# EAGLE design pcb2.0 (EAGLE 9.6.2)
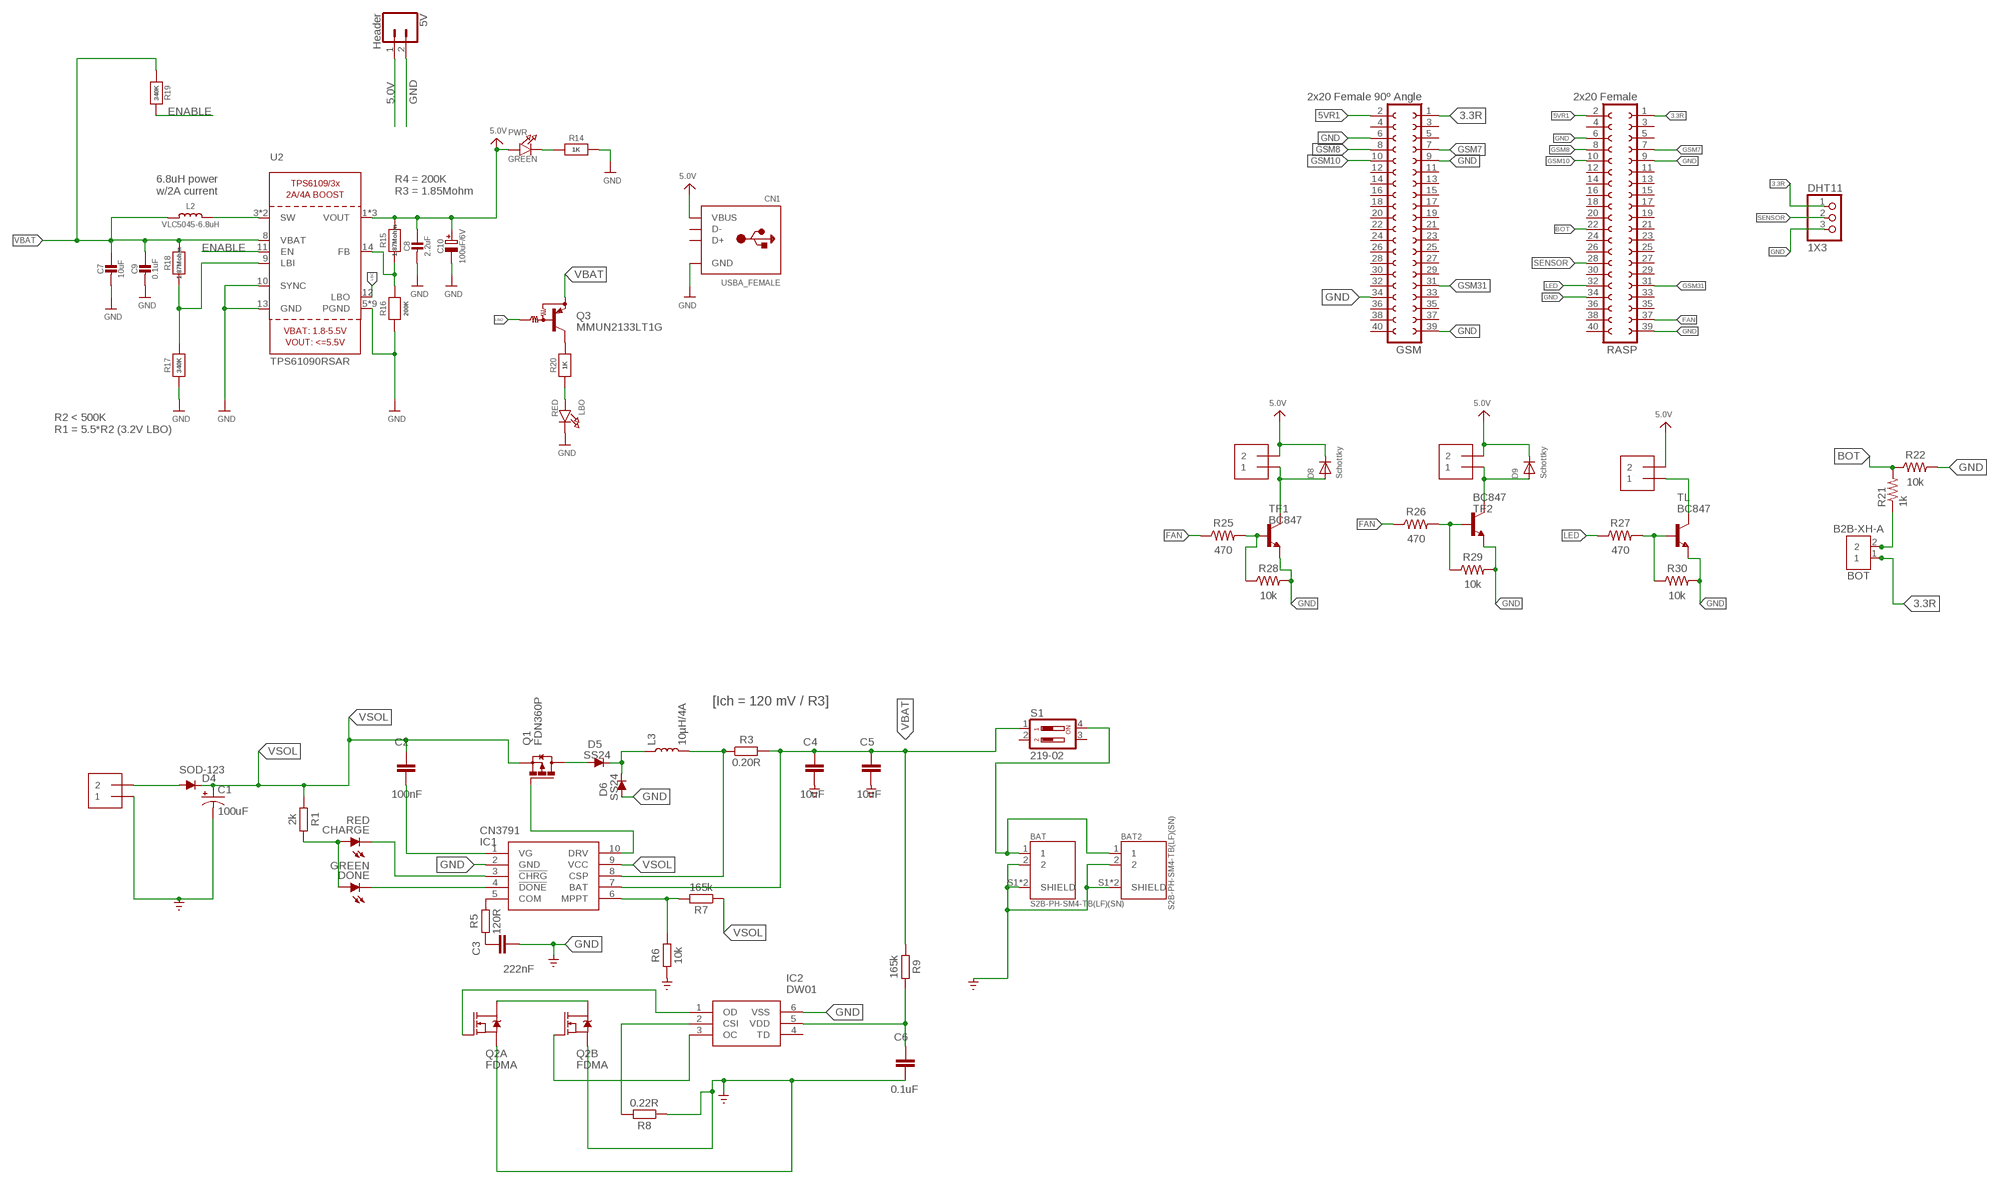
[diagram p0: schematic, sheet 1]

## Parts
5V  Header  CONN_02  [1X02]
BAT  S2B-PH-SM4-TB(LF)(SN)  [S2B-PH-SM4-TB(LF)(SN)]
BAT2  S2B-PH-SM4-TB(LF)(SN)  [S2B-PH-SM4-TB(LF)(SN)]
BOT  B2B-XH-A  [B2B-XH-A]
C1  100uF  CPOL-US153CLV-0505  [153CLV-0505]
C2  100nF  C0603C120J5GACTU  [CAP_0603]
C3  222nF  C0603C120J5GACTU  [CAP_0603]
C4  10uF  C0603C120J5GACTU  [CAP_0603]
C5  10uF  C0603C120J5GACTU  [CAP_0603]
C6  0.1uF  C0603C120J5GACTU  [CAP_0603]
C7  10uF  CAP_CERAMIC0805-NOOUTLINE  [0805-NO]
C8  2.2uF  CAP_CERAMIC0805-NOOUTLINE  [0805-NO]
C9  0.1uF  CAP_CERAMIC0805-NOOUTLINE  [0805-NO]
C10  100uF/6V  CAP_TANTALUMB/3528_REFLOW  [EIA3528-21/B-R]
CHARGE  RED  LED_LEDCHIP-LED0603MP  [LED_CHIP-LED0603MP]
CN1  USBA_FEMALE  USB_TYPEAPTHFML  [USB_HOST-PTH]
D4  SOD-123  DIODE_DIODE-SOD123  [DIODE_SOD123]
D5  SS24  DIODE_DIODE-SOD123  [DIODE_SOD123]
D6  SS24  DIODE_DIODE-SOD123  [DIODE_SOD123]
D8  Schottky  DIODESOD-123  [SOD-123]
D9  Schottky  DIODESOD-123  [SOD-123]
DHT11  1X3  PINHD-1X3  [1X03]
DONE  GREEN  LED_LEDCHIP-LED0603MP  [LED_CHIP-LED0603MP]
FAN1  1X2-3.5MM  [1X2-3.5MM]
FAN2  1X2-3.5MM  [1X2-3.5MM]
GSM  2x20 Female 90º Angle  FE20-2W  [FE20-2W]
IC1  CN3791  [SOP100P600X175-10N]
IC2  DW01  [SOT95P280X135-6N]
L2  VLC5045-6.8uH  INDUCTORTDK_VLC5045  [INDUCTOR_5X5MM_TDK_VLC5045]
L3  10µH/4A  INDUCTOR-CR54-3.3UH  [CR54]
LBO  RED  LED0805_NOOUTLINE  [CHIPLED_0805_NOOUTLINE]
LED  1X2-3.5MM  [1X2-3.5MM]
PWR  GREEN  LED0805_NOOUTLINE  [CHIPLED_0805_NOOUTLINE]
Q1  FDN360P  [SUPER-SOT3]
Q2  FDMA  MOSFET_NCH_DUAL-FDMA1024NZ  [MICROFET_2X2]
Q3  MMUN2133LT1G  MUN2114T1-PNP_DRIVER-SC59-BEC  [SC59-BEC]
R1  2k  R_CHIP-0603(1608-METRIC)  [RESC1608X60]
R3  0.20R  R_CHIP-0603(1608-METRIC)  [RESC1608X60]
R5  120R  R_CHIP-0603(1608-METRIC)  [RESC1608X60]
R6  10k  R_CHIP-0603(1608-METRIC)  [RESC1608X60]
R7  165k  R_CHIP-0603(1608-METRIC)  [RESC1608X60]
R8  0.22R  R_CHIP-0603(1608-METRIC)  [RESC1608X60]
R9  165k  R_CHIP-0603(1608-METRIC)  [RESC1608X60]
R14  1K  RESISTOR0805_NOOUTLINE  [0805-NO]
R15  1.87Mohm  RESISTOR0805_NOOUTLINE  [0805-NO]
R16  200K  RESISTOR0805_NOOUTLINE  [0805-NO]
R17  340K  RESISTOR0805_NOOUTLINE  [0805-NO]
R18  1.87Mohm  RESISTOR0805_NOOUTLINE  [0805-NO]
R19  340K  RESISTOR0805_NOOUTLINE  [0805-NO]
R20  1K  RESISTOR0805_NOOUTLINE  [0805-NO]
R21  1k  R-US_R0805  [R0805]
R22  10k  R-US_CHIP-0805(2012-METRIC)  [RESC2012X65]
R25  470  R-US_CHIP-0805(2012-METRIC)  [RESC2012X65]
R26  470  R-US_CHIP-0805(2012-METRIC)  [RESC2012X65]
R27  470  R-US_CHIP-0805(2012-METRIC)  [RESC2012X65]
R28  10k  R-US_CHIP-0805(2012-METRIC)  [RESC2012X65]
R29  10k  R-US_CHIP-0805(2012-METRIC)  [RESC2012X65]
R30  10k  R-US_CHIP-0805(2012-METRIC)  [RESC2012X65]
RASP  2x20 Female  FE20-2  [FE20-2]
S1  219-02  [CTS-219-02]
TF1  BC847  [SOT23]
TF2  BC847  [SOT23]
TL  BC847  [SOT23]
U2  TPS61090RSAR  VREG_TPS6103X  [PVQFN-16]
VIN  1X2-3.5MM  [1X2-3.5MM]

## Nets
3.3R: BOT.1 DHT11.1 GSM.1 RASP.1
5.0V: 5V.1 C8.1 C10.+ CN1.VBUS D8.C D9.C FAN1.2 FAN2.2 LED.2 PWR.A R15.2 U2.1(VOUT) U2.15(VOUT) U2.16(VOUT)
5VR1: GSM.2 RASP.2
BOT: R21.2 R22.1 RASP.22
ENABLE: R19.2 U2.11(EN)
FAN: R25.1 R26.1 RASP.37
GND: 5V.2 BAT2.2 BAT2.S1(SHIELD) BAT2.S2(SHIELD) BAT.2 BAT.S1(SHIELD) BAT.S2(SHIELD) C1.- C3.2 C4.2 C5.2 C6.2 C7.2 C8.2 C9.2 C10.- CN1.GND D6.A DHT11.3 GSM.6 GSM.9 GSM.34 GSM.39 IC1.2(GND) IC2.6(VSS) LBO.C Q2.S1(A:S) Q2.S2(B:S) R6.1 R8.1 R14.2 R16.1 R17.1 R22.2 R28.2 R29.2 R30.2 RASP.6 RASP.9 RASP.34 RASP.39 TF1.2(E) TF2.2(E) TL.2(E) U2.5(PGND) U2.6(PGND) U2.7(PGND) U2.10(SYNC) U2.13(GND) U2.P$18(PGND) U2.P$19(PGND) U2.P$20(PGND) U2.P$21(PGND) U2.P$22(PGND) U2.THERMAL(PGND) VIN.1 ; supply symbol labelled SUPPLY_BRASTAN_GND_
GSM7: GSM.7 RASP.7
GSM8: GSM.8 RASP.8
GSM10: GSM.10 RASP.10
GSM31: GSM.31 RASP.31
LBO: Q3.B U2.12(LBO)
LED: R27.1 RASP.32
N$2: L2.P$2 U2.3(SW) U2.4(SW)
N$3: C2.2 IC1.1(VG)
N$4: CHARGE.C IC1.3(!CHRG)
N$5: IC1.8(CSP) L3.P$2 R3.1
N$6: CHARGE.A DONE.A R1.2
N$7: DONE.C IC1.4(!DONE)
N$8: IC1.5(COM) R5.2
N$9: C3.1 R5.1
N$10: IC1.10(DRV) Q1.1(G)
N$11: R17.2 R18.1 U2.9(LBI)
N$12: D5.A Q1.3(D)
N$13: D5.C D6.C L3.P$1
N$14: IC1.6(MPPT) R6.2 R7.2
N$15: Q2.D1(A:D) Q2.D1_2(A:D) Q2.D2(B:D) Q2.D2_2(B:D)
N$16: BAT2.1 BAT.1 S1.4
N$17: IC2.1(OD) Q2.G1(A:G)
N$18: IC2.3(OC) Q2.G2(B:G)
N$19: C6.1 IC2.5(VDD) R9.2
N$20: IC2.2(CSI) R8.2
N$21: BOT.2 R21.1
N$22: PWR.C R14.1
N$24: LBO.A R20.1
N$25: Q3.C R20.2
N$26: R15.1 R16.2 U2.14(FB)
N$31: R25.2 R28.1 TF1.1(B)
N$32: R26.2 R29.1 TF2.1(B)
N$33: R27.2 R30.1 TL.1(B)
N$34: D8.A FAN1.1 TF1.3(C)
N$35: D9.A FAN2.1 TF2.3(C)
N$36: LED.1 TL.3(C)
SENSOR: DHT11.2 RASP.28
VBAT: C4.1 C5.1 C7.1 C9.1 IC1.7(BAT) L2.P$1 Q3.E R3.2 R9.1 R18.2 R19.1 S1.1 U2.8(VBAT)
VSOL: C1.+ C2.1 D4.C IC1.9(VCC) Q1.2(S) R1.1 R7.1
VSOLAR [VIN]: D4.A VIN.2
Unconnected: CN1.D+ CN1.D- GSM.3 GSM.4 GSM.5 GSM.11 GSM.12 GSM.13 GSM.14 GSM.15 GSM.16 GSM.17 GSM.18 GSM.19 GSM.20 GSM.21 GSM.22 GSM.23 GSM.24 GSM.25 GSM.26 GSM.27 GSM.28 GSM.29 GSM.30 GSM.32 GSM.33 GSM.35 GSM.36 GSM.37 GSM.38 GSM.40 IC2.4(TD) RASP.3 RASP.4 RASP.5 RASP.11 RASP.12 RASP.13 RASP.14 RASP.15 RASP.16 RASP.17 RASP.18 RASP.19 RASP.20 RASP.21 RASP.23 RASP.24 RASP.25 RASP.26 RASP.27 RASP.29 RASP.30 RASP.33 RASP.35 RASP.36 RASP.38 RASP.40 S1.2 S1.3

## Notes on the sheet
- 6.8uH power
  w/2A current
- R4 = 200K
  R3 = 1.85Mohm
- R2 < 500K
  R1 = 5.5*R2 (3.2V LBO)
- [Ich = 120 mV / R3]

## Library data of the parts
5V = SparkFun-Connectors:CONN_02: Multi connection point. Often used as Generic Header-pin footprint for 0.1 inch spaced/style header connections On any of the 0.1 inch spaced packages, you can populate with these: Break Away Headers - Straight <https://www.sparkfun.com/products/116> (PRT-00116) Break Away Male Headers - Right Angle <https://www.sparkfun.com/products/553> (PRT-00553) Female Headers <https://www.sparkfun.com/products/115> (PRT-00115) Break Away Headers - Machine Pin <https://www.sparkfun.com/products/117> (PRT-00117) Break Away Female Headers - Swiss Machine Pin <https://www.sparkfun.com/products/743> (PRT-00743) For SCREWTERMINALS and SPRING TERMINALS visit here: Screw Terimnals on SparkFun.com <https://www.sparkfun.com/search/results?term=Screw+Terminals> (5mm/3.5mm/2.54mm spacing) This device is also useful as a general connection point to wire up your design to another part of your project. Our various solder wires solder well into these plated through hole pads. Hook-Up Wire - Assortment (Stranded, 22 AWG) <https://www.sparkfun.com/products/11375> (PRT-11375) Hook-Up Wire - Assortment (Solid Core, 22 AWG) <https://www.sparkfun.com/products/11367> (PRT-11367) View the entire wire category on our website here <https://www.sparkfun.com/categories/141> Special notes: Molex polarized connector foot print use with: PRT-08233 with associated crimp pins and housings. 2.54_SCREWTERM for use with PRT-10571. 3.5mm Screw Terminal footprints for PRT-08084 5mm Screw Terminal footprints for use with PRT-08432
BAT BAT2 = Connectors:S2B-PH-SM4-TB(LF)(SN): CONN HEADER SMD R/A 2POS 2MM Manufacturer's datasheet <http://www.jst-mfg.com/product/pdf/eng/ePH.pdf>; CREATED_BY: PCBLayout.com; DIGI_KEY_PART_NUMBER: 455-1749-1-ND; MANUFACTURER: JST Sales America Inc.; MPN: S2B-PH-SM4-TB(LF)(SN); PACKAGE: SMD
BOT = Connector:B2B-XH-A: XH Connector Top Entry - 2POS Details see: Datasheet <http://www.jst-mfg.com/product/pdf/eng/eXH.pdf>; CATEGORY: CONNECTOR; DESCRIPTION: 2.5mm pitch/disconnectable crimp style connector; MANUFACTURER: JST (XH CONNECTOR); MPN: B2B-XH-A; OPERATING_TEMPERATURE: -25°C ~ 85°C; PART_STATUS: ACTIVE; ROHS_COMPLIANT: COMPLIANT; SERIES: B_B-XH-A; SUB_CATEGORY: Through hole connector; TYPE: top entry; VALUE: 3A/250V
C1 = adafruit:CPOL-US: POLARIZED CAPACITOR, American symbol
C2-C6 = Resistor_Capacitor:C0603C120J5GACTU: CAP CER 12PF 50V C0G/NP0 0603 Manufacturer's datasheet <https://content.kemet.com/datasheets/KEM_C1003_C0G_SMD.pdf>; CREATED_BY: PCBLayout.com; DIGIKEY_PART_NUMBER: 399-1050-2-ND; MANUFACTURER: KEMET; MPN: C0603C120J5GACTU; PACKAGE: SMD 0603
C7-C9 = microbuilder:CAP_CERAMIC: Ceramic Capacitors For new designs, use the packages preceded by an '_' character since they are more reliable: The following footprints should be used on most boards: _0402 - Standard footprint for regular board layouts _0603 - Standard footprint for regular board layouts _0805 - Standard footprint for regular board layouts _1206 - Standard footprint for regular board layouts For extremely tight-pitch boards where space is at a premium, the following 'micro-pitch' footprints can be used (smaller pads, no silkscreen outline, etc.): _0402MP - Micro-pitch footprint for very dense/compact boards _0603MP - Micro-pitch footprint for very dense/compact boards _0805MP - Micro-pitch footprint for very dense/compact boards _1206MP - Micro-pitch footprint for very dense/compact boards
C10 = microbuilder:CAP_TANTALUM: Tantalum Capacitors Wave footprints have larger pads and are meant to be used for hand soldering. Reflow footprints are optimised for solder paste and a reflow oven. EIA3216-18/A-[R/W] - Size A / 3216-18 / 1206 footprint 4.7µF 25V 10% Tantalum Capacitor 10µF 16V 10% Tantalum Capacitor [Digikey: 495-2236-2-ND] EIA3528-21/B-[R/W] - Size B / 3528-21 47µF 10V 10% Tantalum Capactior [Digikey: 495-2216-1-ND] EIA6032-28/C-[R/W] - Size C / 6032-28 10µF 35V 20% Tantalum Capacitor [Digikey: 495-2285-1-ND] 100µF 16V 10% Tantalum Capactior [Digikey: 399-5214-1-ND]
CHARGE DONE = 52101-101-REV-A_v16:LED_LED: LED Various Types
CN1 = microbuilder:USB_TYPEA: USB - Type A Connectors Male types stick out and are inserted into a PC or matching females parts (these are the connectors used on USB Memory Sticks, etc.). Female parts are generally used for USB Host and accept a male-type connector. SMT - 4UCON: 10017 PTHFML - Digikey: 609-1045-ND, 4UCon: 05241 PCB - Use 2.0mm thick PCBs with this footprint
D4-D6 = 52101-101-REV-A_v16:DIODE_DIODE-: DIODE
D8 D9 = adafruit:DIODE: Diode SMADIODE - SMA Surface Mount Package 20V 1A Schottky Diode Digikey: 641-1014-6-ND DO-1N4148 - Through Hole Small Current Diode SOD-123 20V 1 A (.5mV Vf) Schottky Diode - Digikey: MBRX120TPMSCT-ND SOD-323 10V 570mA (.38mV Vf, 3ns) Schottky Diode - Digikey: ZLLS410CT-ND SOD-523 30V 30mA Schottky Diode (RB751S-40TE61) - Digikey: RB751S-40TE61CT-ND SOT23-R/W - SOT23 Package (R = Solder Paste/Reflow Ovens, W = Hand-Soldering) BAT54Film 40V 300mA - Digikey: 497-7162-1-ND
DHT11 = adafruit:PINHD-1X3: PIN HEADER
FAN1 FAN2 LED VIN = adafruit:1X2: 3.5mm Terminal block http://www.ladyada.net/library/pcb/eaglelibrary.html
GSM = con-lsta:FE20-2W: FEMALE HEADER; OC_FARNELL: unknown; OC_NEWARK: unknown
IC1 = CN3791:CN3791: ic Source: Datasheet <http://www.consonance-elec.com/pdf/datasheet/DSE-CN3791.pdf>; DESCRIPTION: ic; HEIGHT: 1.75mm; MANUFACTURER_NAME: Consonance; MANUFACTURER_PART_NUMBER: CN3791
IC2 = DW01:DW01: ic Source: Datasheet <https://datasheet.lcsc.com/szlcsc/1906271838_SLKORMICRO-Elec-DW01_C359989.pdf>; DESCRIPTION: ic; HEIGHT: 1.35mm; MANUFACTURER_NAME: Slkor; MANUFACTURER_PART_NUMBER: DW01
L2 = microbuilder:INDUCTOR: Inductors
L3 = SparkFun-Coils:INDUCTOR: Inductors; PROD_ID: NDUC-11157; VALUE: 3.3µH/±30%/3.4A
LBO PWR = microbuilder:LED: LED 0603 - 0603 Surface Mount Package 2mA: Green LED - Low Power (3.9mcd, 2ma, 1.7Vf) - Digikey: 475-2709-2-ND Orange LED - Low Power (9.8mcd, 2ma, 1.8Vf) - Digikey: 475-1194-2-ND Red LED - Low Power (5mcd, 2ma, 1.8Vf) - Digikey: 475-1195-2-ND Yellow LED - Low Power (7mcd, 2ma, 1.8Vf) - Digikey: 475-1196-2-ND 5mA: Blue LED - Low Power (17mcd, 5ma, 2.9Vf) - Digikey: LNJ937W8CRACT-ND 0805 - 0805 Surface Mount Package 2mA: Red LED (8.8mcd, 2mA, 1.8Vf, Clear) - Low Power [Digikey: 475-2510-1-ND] Green LED (5mcd, 2mA, 1.8Vf, Clear) - Low Power [Digikey: 475-2730-1-ND] Yellow LED (11.3mcd, 2mA, 1.8Vf, Clear) - Low Power [Digikey: 475-2555-1-ND] 20mA: Red LED (104mcd, 20mA, Diffused) - LS R976 [Digikey: 475-1278-6-ND] Red LED (12mcd, 20mA, 2.0Vf, Clear) - APT2012EC [Digikey: 754-1128-1-ND] Green LED (15mcd, 20mA, 2.2Vf, Clear) - APT2012GC [Digikey: 754-1131-1-ND] Orange LED (160mcd, 20mA, 2.1Vf, Clear) - APT2012SECK [Digikey: 754-1130-1-ND] 1206 - 1206 Surface Mount Package Green LED (26mcd, 20mA, Diffused) - LG N971 [Digikey: 475-1407-6-ND] Red LED (15mcd, 20mA, Diffused) - LH N974 [Digikey: 475-1416-6-ND] Cree - Cree High-Power Surface Mount LEDs XPEBWT-L1-0000-00D50 - White 111lm 350mA 2.9Vf 6200K 110° XTEAWT-00-0000-00000LEE3 - White 114lm 350mA 2.85Vf 5000K 115° Everlight - Everlight 45-21 Series Surface Mount LEDs 45-21/QK2C-B2832AC2CB2/2T - Warm White 2000mcd 20mA 3.25Vf 3050K 120° 45-21/LK2C-B38452C4CB2/2T - Nuetral White 2000mcd 20mA 3.25Vf 4150K 120° 45-21/LK2C-B50634C6CB2/2T - Cold White 2200mcd 20mA 3.25Vf 5650K 120° PLCC2 Reverse Mount LS T77K-J1L2-1-0-2-R18-Z - Red 11.25mcd 2mA 1.8Vf 630nm 120° LO T77K-L1M2-24-Z - Orange 19.6mcd 2mA 1.8Vf 606nm 120° LY T77K-K2M1-26-Z - Yellow 15.7mcd 2mA 1.8Vf 587nm 120°
Q1 = transistor-power:FDN360P: Single P-Channel, PowerTrench (R) MOSFET Source: http://www.fairchildsemi.com/ds/FD/FDN360P.pdf
Q2 = SparkFun-DiscreteSemi:MOSFET_NCH_DUAL: Dual N-Channel 30-VDS MOSFET Link to datasheet <https://www.fairchildsemi.com/datasheets/FD/FDMA1024NZ.pdf> SparkFun Products: SparkFun Mini FET Shield <https://www.sparkfun.com/products/9627>; PROD_ID: TRANS-09516; VALUE: 5A/20V/54mΩ
Q3 = transistor:*-PNP_DRIVER-: PNP Bias Resistor Transistor
R1 R3 R5-R9 = Resistor:R: Resistor Fixed - Generic; CATEGORY: Resistor; SUB-CATEGORY: Fixed
R14-R20 = microbuilder:RESISTOR: Resistors For new designs, use the packages preceded by an '_' character since they are more reliable: The following footprints should be used on most boards: _0402 - Standard footprint for regular board layouts _0603 - Standard footprint for regular board layouts _0805 - Standard footprint for regular board layouts _1206 - Standard footprint for regular board layouts For extremely tight-pitch boards where space is at a premium, the following 'micro-pitch' footprints can be used (smaller pads, no silkscreen outline, etc.): _0402MP - Micro-pitch footprint for very dense/compact boards _0603MP - Micro-pitch footprint for very dense/compact boards _0805MP - Micro-pitch footprint for very dense/compact boards _1206MP - Micro-pitch footprint for very dense/compact boards
R21 = rcl:R-US_: RESISTOR, American symbol; SPICEPREFIX: R
R22 R25-R30 = Resistor:R-US: Resistor Fixed - ANSI; CATEGORY: Resistor; SUB-CATEGORY: Fixed
RASP = con-lsta:FE20-2: FEMALE HEADER; OC_FARNELL: unknown; OC_NEWARK: unknown
S1 = switch-dil:219-02*: Surface Mount DIP Switch Series 219 SMT CTS Electronic Components Sourc: www.ctscorp.com; OC_FARNELL: unknown; OC_NEWARK: unknown
TF1 TF2 TL = transistor@1:BC847: NPN TRANSISTOR
U2 = microbuilder:VREG_TPS6103X: TPS6103x 4A Boost - 1.8-5.5V Input, Adjustable Output to 5.5V

## Board
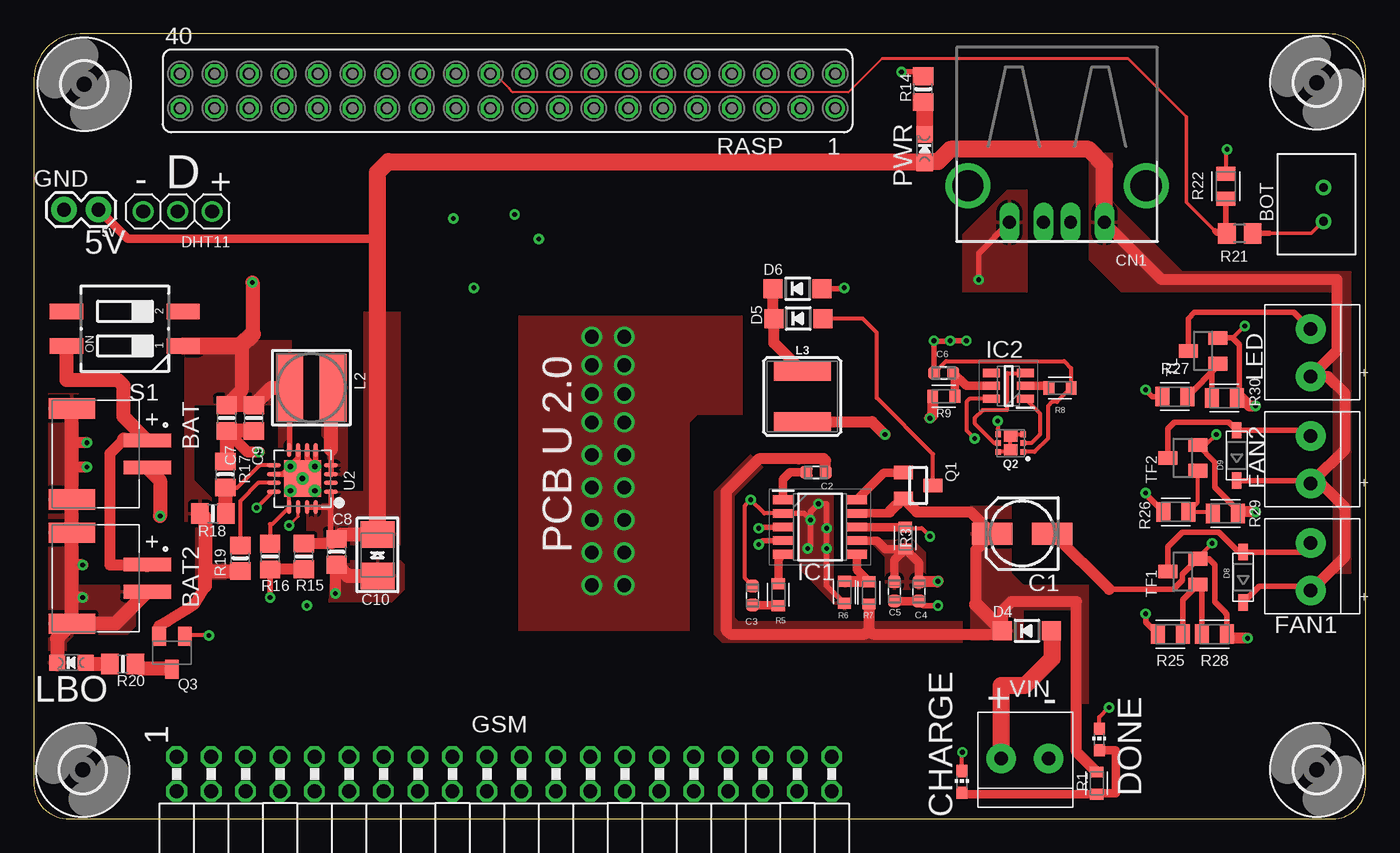
[diagram p1: board, top side]
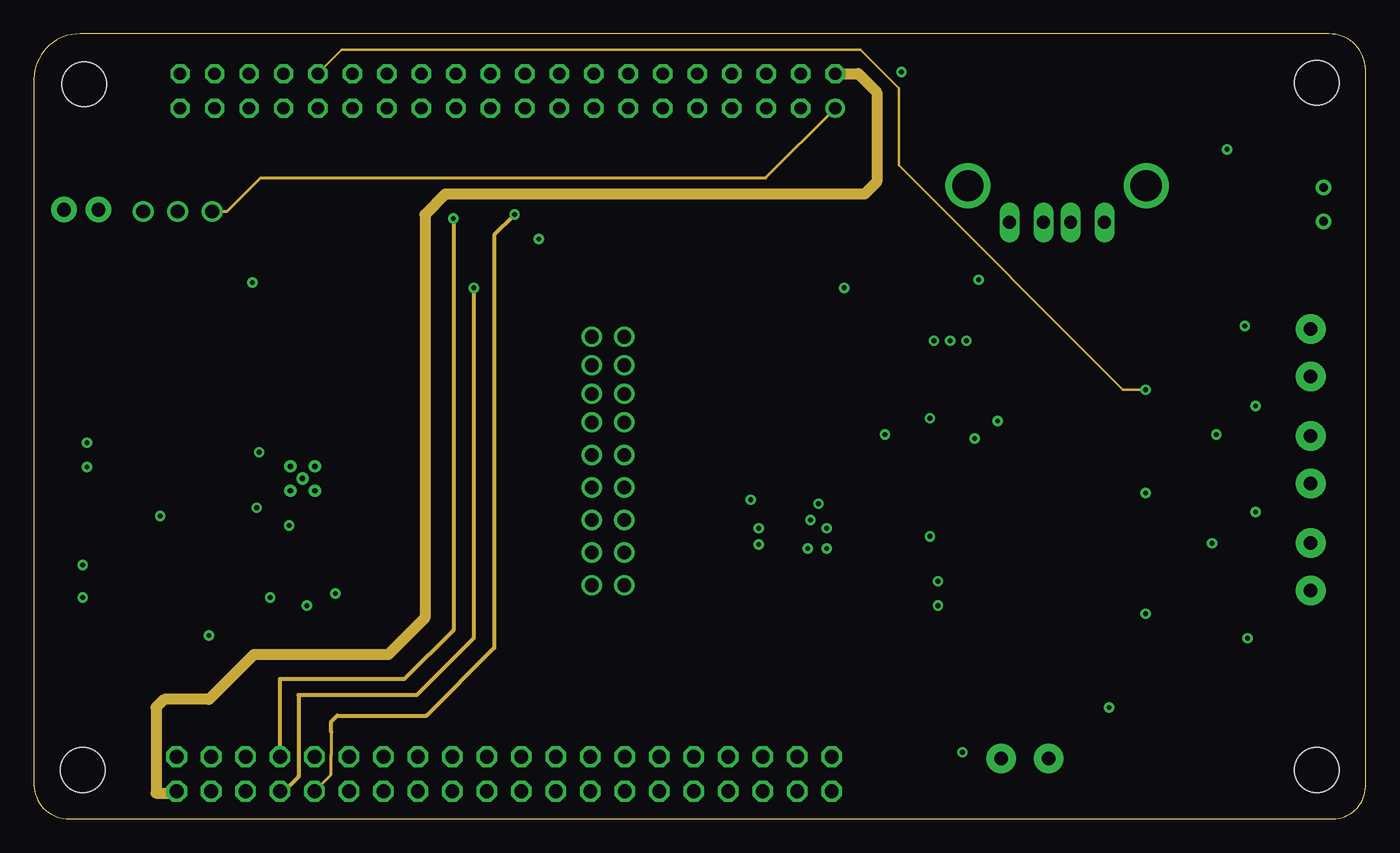
[diagram p2: board, inner layer Route2]
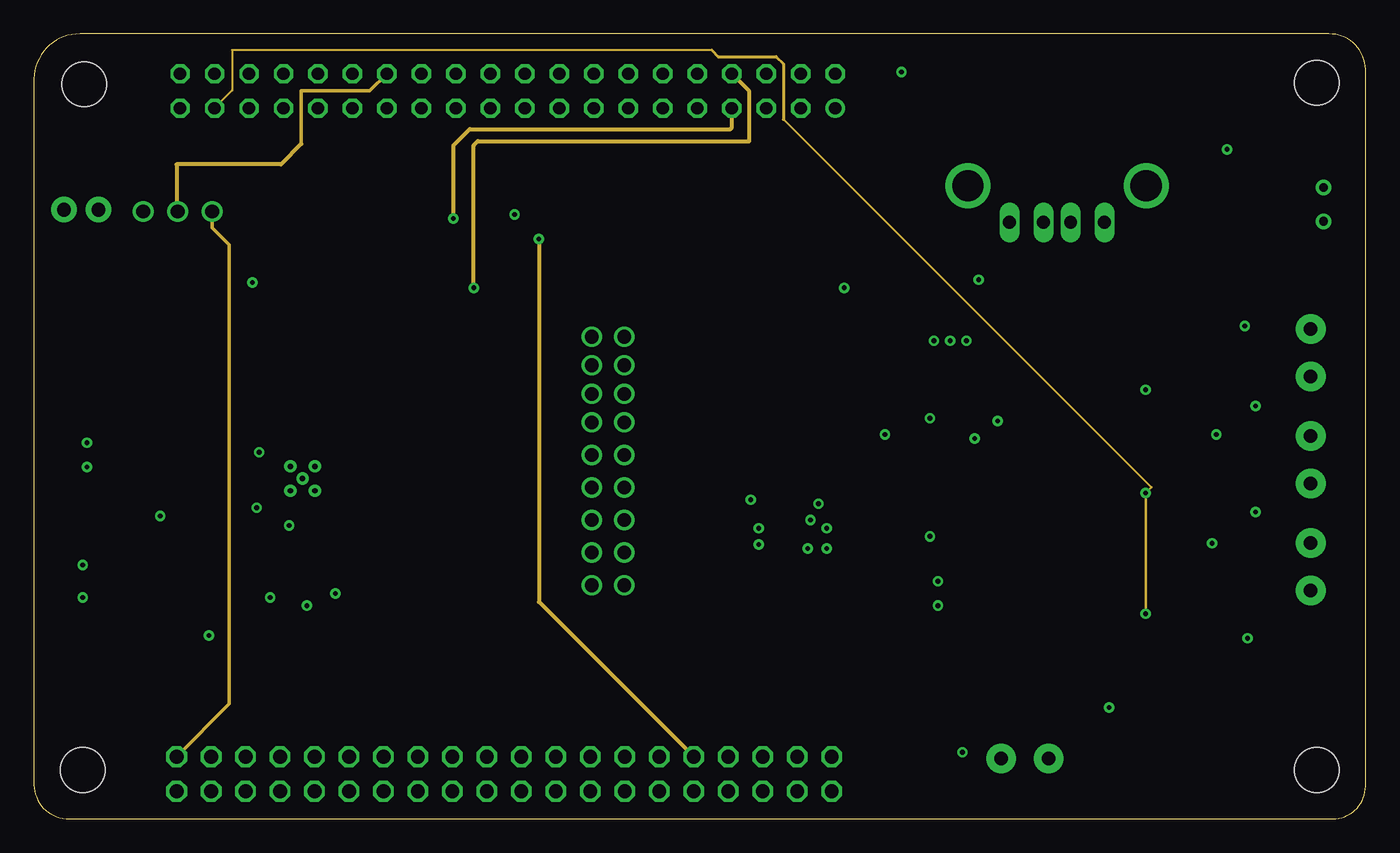
[diagram p3: board, inner layer Route15]
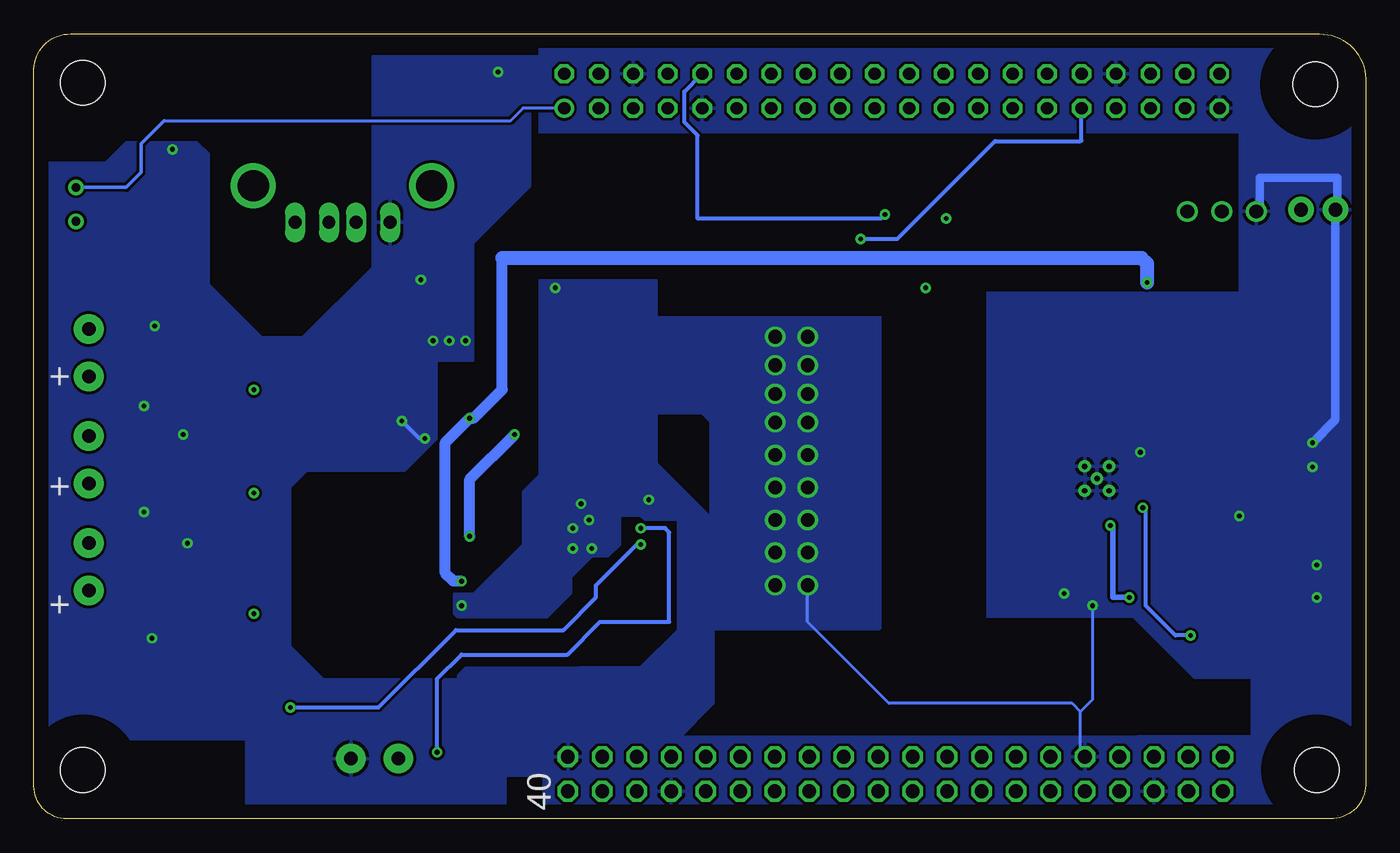
[diagram p4: board, bottom side, seen from below]

Size 98.1 x 57.8 mm. Coordinates in mm from the lower left corner, seen from the top.
Outline: 95.7,0 arc90 98.1,2.4 98.1,55.2 arc90 95.4,57.8 3.4,57.8 arc90 0,54.5 0,2.5 arc90 2.6,0 95.7,0
Copper layers (1+2*15+16): Top 0.035mm / dielectric 1.5mm / Route2 0.035mm / dielectric 0.15mm / Route15 0.035mm / dielectric 0.2mm / Bottom 0.035mm
Design rules "default *": minimum track width 6mil, minimum drill 0.35mm, track to track 8mil, track to pad 6mil, pad to pad 6mil, via to via 6mil, smd to smd 6mil, copper to edge 40mil, drill to drill 6mil, minimum pad ring 10mil, minimum via ring 8mil, stop-mask expansion 4mil, vias tented up to drill 0mil, thermal gap 10mil

### Footprints (pad centres in the part's own frame; a part is rotated, then mirrored left to right if it is on the bottom)
1X02 = drill 1.016 pad 1.88: 1 0,0; 2 2.54,0
S2B-PH-SM4-TB(LF)(SN) = smd 1 x 3.5: 1 -1,0; 2 1,0 | smd 1.5 x 3.4: S1 -3.35,-5.55; S2 3.35,-5.55
B2B-XH-A = drill 0.64: 1 0,0; 2 2.5,0
153CLV-0505 = smd 3 x 1.6: + 2.2,0; - -2.2,0
CAP_0603 = smd 0.92 x 0.93: 1 -0.705,0; 2 0.705,0
0805-NO = smd 1.3 x 1.5: 1 -0.95,0; 2 0.95,0
EIA3528-21/B-R = smd 1.95 x 2.5: + 1.525,0; - -1.525,0
LED_CHIP-LED0603MP = smd 0.8 x 0.9: A 0,-0.794; C 0,0.794
USB_HOST-PTH = drill 0.95 long: D+ 1,6.52; D- -1,6.52; GND 3.5,6.52; VBUS -3.5,6.52 | drill 2.3 pad 2.9: S1 -6.57,3.81; S2 6.57,3.81
DIODE_SOD123 = smd 1.4 x 1.4: A 1.805,0; C -1.805,0
SOD-123 = smd 1.2 x 0.7: A 1.85,0; C -1.85,0
1X03 = drill 1.016: 1 -2.54,0; 2 0,0; 3 2.54,0
1X2-3.5MM = drill 1 pad 2.184: 1 1.8,0; 2 -1.7,0
FE20-2W = drill 1.016 octagon: 1 -24.13,1.27; 2 -24.13,-1.27; 3 -21.59,1.27; 4 -21.59,-1.27; 5 -19.05,1.27; 6 -19.05,-1.27; 7 -16.51,1.27; 8 -16.51,-1.27; 9 -13.97,1.27; 10 -13.97,-1.27; 11 -11.43,1.27; 12 -11.43,-1.27; 13 -8.89,1.27; 14 -8.89,-1.27; 15 -6.35,1.27; 16 -6.35,-1.27; 17 -3.81,1.27; 18 -3.81,-1.27; 19 -1.27,1.27; 20 -1.27,-1.27; 21 1.27,1.27; 22 1.27,-1.27; 23 3.81,1.27; 24 3.81,-1.27; 25 6.35,1.27; 26 6.35,-1.27; 27 8.89,1.27; 28 8.89,-1.27; 29 11.43,1.27; 30 11.43,-1.27; 31 13.97,1.27; 32 13.97,-1.27; 33 16.51,1.27; 34 16.51,-1.27; 35 19.05,1.27; 36 19.05,-1.27; 37 21.59,1.27; 38 21.59,-1.27; 39 24.13,1.27; 40 24.13,-1.27
SOP100P600X175-10N = smd 1.525 x 0.65: 1 -2.712,2; 2 -2.712,1; 3 -2.712,0; 4 -2.712,-1; 5 -2.712,-2; 6 2.712,-2; 7 2.712,-1; 8 2.712,0; 9 2.712,1; 10 2.712,2
SOT95P280X135-6N = smd 1.25 x 0.6: 1 -1.25,0.95; 2 -1.25,0; 3 -1.25,-0.95; 4 1.25,-0.95; 5 1.25,0; 6 1.25,0.95
INDUCTOR_5X5MM_TDK_VLC5045 = smd 2 x 5: P$1 -1.6,0; P$2 1.6,0
CR54 = smd 4.2 x 1.4: P$1 0,1.85; P$2 0,-1.85
CHIPLED_0805_NOOUTLINE = smd 1.2 x 1.2: A 0,-1.05; C 0,1.05
SUPER-SOT3 = smd 1 x 1.4: 1 -0.95,-1.1; 2 0.95,-1.1; 3 0,1.1
MICROFET_2X2 = smd 0.8 x 1: D1 0.5,0; D2 -0.5,0 | smd 0.42 x 0.42: D1_2 0.65,-0.915; D2_2 -0.65,0.915; G1 0,0.915; G2 0,-0.915; S1 0.65,0.915; S2 -0.65,-0.915
SC59-BEC = smd 1 x 1.4: B -0.95,-1.2; C 0,1.2; E 0.95,-1.2
RESC1608X60 = smd 0.799 x 0.974: 1 -0.815,0; 2 0.815,0
R0805 = smd 1.3 x 1.5: 1 -0.95,0; 2 0.95,0
RESC2012X65 = smd 1.031 x 1.42: 1 -0.919,0; 2 0.919,0
FE20-2 = drill 0.914: 1 -24.13,1.27 | drill 0.914 octagon: 2 -24.13,-1.27; 3 -21.59,1.27; 4 -21.59,-1.27; 5 -19.05,1.27; 6 -19.05,-1.27; 7 -16.51,1.27; 8 -16.51,-1.27; 9 -13.97,1.27; 10 -13.97,-1.27; 11 -11.43,1.27; 12 -11.43,-1.27; 13 -8.89,1.27; 14 -8.89,-1.27; 15 -6.35,1.27; 16 -6.35,-1.27; 17 -3.81,1.27; 18 -3.81,-1.27; 19 -1.27,1.27; 20 -1.27,-1.27; 21 1.27,1.27; 22 1.27,-1.27; 23 3.81,1.27; 24 3.81,-1.27; 25 6.35,1.27; 26 6.35,-1.27; 27 8.89,1.27; 28 8.89,-1.27; 29 11.43,1.27; 30 11.43,-1.27; 31 13.97,1.27; 32 13.97,-1.27; 33 16.51,1.27; 34 16.51,-1.27; 35 19.05,1.27; 36 19.05,-1.27; 37 21.59,1.27; 38 21.59,-1.27; 39 24.13,1.27; 40 24.13,-1.27
CTS-219-02 = smd 1.13 x 2.44: 1 -1.27,-4.3; 2 1.27,-4.3; 3 1.27,4.3; 4 -1.27,4.3
SOT23 = smd 1 x 1.4: 1 -0.95,-1.1; 2 0.95,-1.1; 3 0,1.1
PVQFN-16 = smd 1.05 x 0.35: 1 -2.1,0.975; 2 -2.1,0.325; 3 -2.1,-0.325; 4 -2.1,-0.975; 9 2.1,-0.975; 10 2.1,-0.325; 11 2.1,0.325; 12 2.1,0.975 | smd 0.35 x 1.05: 5 -0.975,-2.1; 6 -0.325,-2.1; 7 0.325,-2.1; 8 0.975,-2.1; 13 0.975,2.1; 14 0.325,2.1; 15 -0.325,2.1; 16 -0.975,2.1 | drill 0.4: P$18 0,0; P$19 -0.9,0.9; P$20 0.9,0.9; P$21 0.9,-0.9; P$22 -0.9,-0.9 | smd 2.7 x 2.7: THERMAL 0,0
3,3 = hole 3.3: 0,0

### Placement (x,y rotation side)
5V  4.76,44.86 180 top
BAT  8.35,26.86 270 top
BAT2  8.35,17.72 270 top
BOT  95,46.5 270 top
C1  72.8,21 180 top
C2  57.62,25.51 180 top
C3  52.94,16.45 90 top
C4  65.19,16.74 270 top
C5  63.39,16.75 270 top
C6  67.02,32.83 180 top
C7  14.2,29.51 270 top
C8  22.3,19.66 270 top
C9  16.2,29.51 270 top
C10  25.31,19.42 90 top
CHARGE  68.36,2.72 0 top
CN1  75.37,50.44 180 top
D4  73.16,13.84 0 top
D5  56.31,36.84 0 top
D6  56.26,39.04 0 top
D8  89.08,17.79 90 top
D9  88.61,26.76 90 top
DHT11  10.59,44.73 180 top
DONE  78.48,5.84 0 top
FAN1  94.06,18.51 90 top
FAN2  94.06,26.39 90 top
GSM  34.64,3.3 0 top
IC1  57.91,21.49 0 top
IC2  71.79,31.88 180 top
L2  20.43,31.74 0 top
L3  56.6,31.1 0 top
LBO  2.76,11.5 90 top
LED  94.06,34.27 90 top
PWR  65.62,49.34 0 top
Q1  65.14,24.55 270 top
Q2  71.95,27.67 270 top
Q3  10.18,12.23 180 top
R1  78.29,2.63 270 top
R3  64.19,20.68 270 top
R5  54.84,16.5 90 top
R6  59.71,16.68 90 top
R7  61.51,16.64 90 top
R8  75.59,31.73 180 top
R9  67.02,31.11 0 top
R14  65.5,53.74 90 top
R15  19.88,19.33 90 top
R16  17.4,19.31 270 top
R17  14.1,25.36 270 top
R18  13.19,22.48 180 top
R19  15.2,19.19 90 top
R20  6.54,11.4 0 top
R21  88.83,43.11 180 top
R22  87.8,46.59 90 top
R25  83.71,13.6 0 top
R26  84.13,22.6 0 top
R27  84.05,31.1 0 top
R28  86.97,13.6 0 top
R29  87.78,22.49 0 top
R30  87.7,30.99 0 top
RASP  34.9,53.6 180 top
S1  6.7,36.1 90 top
TF1  84.63,18.2 90 top
TF2  84.63,26.58 90 top
TL  86.13,34.46 90 top
U2  19.79,25.06 180 top
U$5  [3,3]  3.6,3.6 90 top
U$9  [3,3]  3.7,54.1 90 top
U$10  [3,3]  94.5,54.2 90 top
U$11  [3,3]  94.5,3.6 90 top
VIN  72.95,4.44 0 top

### Tracks (layer width: path | path; a pad name or v marks a point on that pad's centre or on a via)
3.3R
  Route2 0.203: DHT11.1 14.23,44.73 16.7,47.2 53.9,47.2 RASP.1
  Route15 0.254: DHT11.1 13.13,43.53 14.4,42.26 14.4,8.46 GSM.1
  Bottom 0.203: RASP.1 62.07,52.33 63,51.4 88.5,51.4
  Bottom 0.254: 88.5,51.4 90.2,49.7 90.2,47.6 91.3,46.5 BOT.1
5.0V
  Top 0.406: 21.84,22.96 U2.16 U2.15 | 21.84,22.96 21.9,22.9 U2.1 | C8.1 21.84,21.07 21.84,22.96 | FAN1.2 93.73,17.14 90.28,17.14 D8.C | D9.C 93.84,24.91 FAN2.2
  Top 0.61: 25.31,42.7 6.92,42.7 5V.1
  Top 0.813: R15.2 21.97,20.28 C8.1 | CN1.VBUS 83.09,39.7 96,39.7 96,34.51 LED.2 95.33,32.57 96.6,31.3 96.6,27.23 94.28,24.92 | FAN2.2 94.28,24.92 | FAN1.2 96.6,19.35 96.6,22.9 94.59,24.92 94.28,24.92
  Top 1.016: C8.1 22.63,20.95 C10.+
  Top 1.27: C10.+ 25.31,42.7 25.31,47.61 26.1,48.4 65.51,48.4 | 65.51,48.4 PWR.A | CN1.VBUS 78.87,48.13 77.7,49.3 67.5,49.3 66.6,48.4 65.51,48.4
  pour Top: 20.1,20.2 27,20.2 27,37.3 24.3,37.3 24.3,24.1 21.9,24.1 21.9,23.2 20.1,23.2
  pour Top: 95.7,18.1 97.4,18.1 97.4,40.3 84.6,40.3 79.5,45.4 79.5,49 77.7,49 77.7,41.2 80.1,38.8 95.7,38.8
5VR1
  Route2 0.813: RASP.2 60.73,54.87 62.1,53.5 62.1,46.9 61.2,46 30.3,46 28.8,44.5 28.8,14.8 26.1,12.1 16.2,12.1 12.9,8.8 9.6,8.8 9,8.2 9,1.9 10.38,1.9 GSM.2
BOT
  Top 0.152: 62.5,56.01 60,53.51 48.61,53.51 48.6,53.5 35.28,53.5 34.99,53.79
  Top 0.2: RASP.22 33.91,54.87 34.99,53.79
  Top 0.203: 84.9,51.7 80.59,56.01 62.5,56.01
  Top 0.254: 87,43.3 84.9,45.4 84.9,51.7
  Top 0.406: R22.1 87.8,43.19 R21.2 87.19,43.11 87,43.3
ENABLE
  Top 0.305: U2.11 16.54,24.73 15.2,23.4 R19.2
FAN  (via drill 0.35)
  Top 0.406: R25.1 81.9,14.49 v81.9,15.1 | R26.1 81.9,23.91 v81.9,24
  Route15 0.152: 49.94,56.6 14.6,56.6 14.6,53.64
  Route15 0.2: v81.9,15.1 v81.9,24 82.3,24.4 55.2,51.5 | 14.6,53.64 13.31,52.35 RASP.37
  Route15 0.203: 49.94,56.6 50.41,56.13 54.67,56.13 55.2,55.6 55.2,51.5
GND  (via drill 0.35, 0.35 pad 0.65, 1 pad 0.95, 1 pad 1.3)
  Top 0.305: 18.81,24.08 U2.13 17.55,21.7 17.4,21.7 R16.1 | Q2.S2 71.04,28.66 71,28.7 v71,29.3 | IC2.6 68.93,30.93 68.7,30.7 68.7,28.6 v69.3,28 | C6.2 67.19,33.7 75.9,33.7 76.41,33.19 R8.1 75.38,30.7 75,30.7 74.7,30.4 74.7,28 73.72,27.02 Q2.S1 | C3.2 52.39,17.7 52.39,23.09 v52.8,23.5 53.81,22.49 IC1.2 | TF1.2 85.73,19.23 v86.8,20.3 | v87.1,28.3 86.33,27.53 TF2.2 | TL.2 88.31,35.41 v89.2,36.3 | v87.9,49.3 87.8,49.2 R22.2
  Top 0.406: 18.81,24.08 U2.P$20 | U2.10 18.31,25.39 U2.P$21 19.46,26.54 U2.7 | U2.6 20.11,26.54 U2.P$22 20.77,26.04 U2.5 | v57.2,22 57.2,22.6 v57.8,23.2 58.4,23.2 v58.4,21.4 v58.4,19.9 58.4,17.18 R6.1 | v57,19.9 57.2,20.1 v57.2,22 | v57.2,22 56.71,22.49 IC1.2 | TL.2 88.29,35.41 88.8,34.9 88.8,31.17 R30.2 | R28.2 87.89,15.08 87.78,15.19 87.78,15.22 87,16 87,18.7 86.55,19.15 TF1.2 84.59,18.01 84.59,17.55 83.93,16.9 79.22,16.9 | R29.2 88.81,22.59 87,24.4 87,26.26 TF2.2 | R14.2 65.19,55 v63.9,55 | v69.6,39.7 69.6,41.65 CN1.GND | v59.7,39.1 59.64,39.04 D6.A | v66.6,15.7 65.53,15.7 C4.2 | C6.2 66.32,35.18 | 66.32,35.18 v66.3,35.2 | v68.7,35.2 v67.5,35.2 67.48,35.18 66.32,35.18
  Top 0.61: C4.2 63.4,16.04 C5.2
  Top 0.813: C8.2 22.2,18.61 v22.2,16.6 | v16.6,27 15.76,27 C7.2 | v3.6,16.3 2.8,16.3 | v3.6,18.7 2.8,18.7 | v3.9,25.9 2.8,25.9 | v3.9,27.7 2.8,27.7 | v89.4,13.3 88.19,13.3 R28.2 | v90,22.6 88.81,22.6 88.81,22.59 | v90,30.4 89.57,30.4 88.8,31.17 | C1.- 75.12,21 79.22,16.9
  Top 1.016: BAT2.S2 2.8,16.3 2.8,18.7 BAT2.S1 BAT.S2 2.8,25.9 2.8,27.7 BAT.S1 | BAT2.S2 1.71,13.28 LBO.C | BAT2.2 6,14.37 BAT2.S2 | R17.1 14.2,26.41 C7.2 C9.2 | C8.2 23.11,17.89 C10.- | BAT.2 9.3,24.91 v9.3,22.3
  Bottom 0.203: GSM.9 21,4.9 21,7.9 | 21,7.9 21.6,8.5 35.1,8.5 41.1,14.5 v41.1,17.2 | 21,7.9 20.1,8.8 v20.1,15.7
  Bottom 0.305: v71,29.3 69.7,28 v69.3,28
  Bottom 0.61: v3.9,27.7 2.22,29.38 5V.2 2.1,44.98 2.1,47.2 7.8,47.2 7.8,44.98 DHT11.3
  other vias: 41.1,19.6 41.1,22 41.1,24.4 41.1,26.8 41.1,29.2 43.5,29.2 43.5,26.8 43.5,24.4 43.5,22 43.5,19.6 43.5,17.2 41.1,31.3 43.5,31.3 41.1,33.4 43.5,33.4 41.1,35.5 43.5,35.5
  pour Bottom: -0.3,10.3 12.6,10.3 17.1,14.8 27.9,14.8 27.9,38.8 -0.3,38.8
  pour Bottom: 81.3,5.8 97.5,5.8 97.5,48.4 92.8,48.4 91.3,49.9 86.1,49.9 85.2,49 85.2,39.4 81.3,35.5
  pour Top: 59.1,15.4 60,15.4 60,15.7 58.9,16.8 58.9,23.8 56.4,23.8 56.4,18.4 59.1,15.7
  pour Bottom: 3.9,0.1 60.6,0.1 60.6,5.8 60.3,6.1 9.9,6.1
  pour Bottom: 9.3,50.5 60.9,50.5 60.9,57.6 0.1,57.6 0.1,38.5 9.3,38.5
  pour Bottom: 57.6,3.1 64.5,3.1 66.9,5.5 66.9,10.6 66.3,11.2 57.6,11.2
  pour Bottom: 60.6,50.2 63.3,52.9 64.2,52.9 64.2,56.2 60.6,56.2
  pour Bottom: 35.8,13.9 48.3,13.9 48.3,29.2 48.9,29.8 52.2,29.8 52.2,37 35.7,37 35.7,14
  pour Top: 35.7,13.9 48.3,13.9 48.3,29.2 48.9,29.8 52.2,29.8 52.2,37 35.7,37
  pour Top: 0,10.9 2.1,10.9 2.4,11.2 2.4,13 3,13.6 6.9,13.6 7.5,14.2 7.5,17.2 3.3,17.2 3.3,31.3 0,31.3
  pour Top: 68.4,38.8 73.2,38.8 73.2,46.3 71.7,46.3 68.4,43
  pour Top: 21.71,16 26.4,16 27.3,16.9 27.3,18.7 27,19 21.94,19
  pour Bottom: 57.9,5.8 50.7,5.8 48,8.5 48,22 52.2,26.2 52.2,39.7 60.9,39.7 60.9,25.3 62.1,24.1 62.1,20.2 65.7,16.6 67.2,16.6 67.2,15.1 66.9,14.8 60.3,14.8 58.5,16.6 58.5,17.8 57,19.3 55.8,19.3 54.9,20.2 54.9,22.3 53.4,22.3 53.1,22 50.7,22 50.7,13.9 53.4,11.2 57.9,11.2
  pour Bottom: 82.5,35.5 82.5,0.1 64.2,0.1 63.3,1 63.3,10.3 76.8,10.3 79.2,12.7 79.2,24.4 78,25.6 70.8,25.6 68.4,28 68.4,33.7 65.7,33.7 65.7,42.4 61.5,46.6 61.5,56.2 73.2,56.2 73.2,40.6 78.3,35.5
  pour Bottom: 16.8,6.1 16.8,0.1 0,0.1 0,12.7 8.4,12.7 8.4,6.1
GSM7  (via drill 0.35)
  Route2 0.305: GSM.7 18.13,10.3 27.3,10.3 30.9,13.9 v30.9,44.2
  Route15 0.305: v30.9,44.2 30.9,49.6 32.1,50.8 51.3,50.8 51.41,50.91 RASP.7
GSM8  (via drill 0.35)
  Route2 0.305: v32.4,39.1 32.4,13.3 28.2,9.1 19.5,9.1 19.5,3.1 18.43,2.03 GSM.8
  Route15 0.305: v32.4,39.1 32.4,49.6 32.7,49.9 52.7,49.9 52.7,53.58 RASP.8
GSM10  (via drill 0.35)
  Route2 0.203: 21.9,6.4 21.9,4.7 21.89,4.69 21.89,3.25 GSM.10
  Route2 0.305: 21.9,6.4 21.9,7.16 22.34,7.6 28.92,7.6 33.9,12.58 33.9,43 v35.4,44.5
  Bottom 0.305: v35.4,44.5 35.7,44.2 49.2,44.2 49.2,50.32 50.19,51.31 50.19,53.55 RASP.10
GSM31  (via drill 0.35)
  Route15 0.305: GSM.31 37.2,15.98 v37.2,42.7
  Bottom 0.305: v37.2,42.7 34.5,42.7 27.3,49.9 21,49.9 20.93,49.97 RASP.31
LBO  (via drill 0.35)
  Top 0.305: v12.9,13.5 11.2,13.5 Q3.B | U2.12 17.59,24.08 v16.4,22.9
  Bottom 0.305: v12.9,13.5 14,13.5 16.2,15.7 16.2,22.7 v16.4,22.9
LED  (via drill 0.35)
  Top 0.406: R27.1 82.4,31.1 v81.9,31.6
  Route2 0.2: v81.9,31.6 80.23,31.6 63.71,48.12 63.71,53.79 60.87,56.63 22.67,56.63 20.93,54.89 RASP.32
N$2
  Top 0.406: U2.3 U2.4 21.89,27.19 21.9,27.2
  Top 1.016: 21.89,27.19 21.89,31.6 L2.P$2
  pour Top: 21.2,34.4 21.2,28.2 21.4,28 21.4,27.1 21.6,26.9 21.6,25.2 22.6,25.2 23.1,25.7 23.1,34.4
N$3
  Top 0.61: C2.2 55.71,25.51 55.2,25 IC1.1
N$4  (via drill 0.35)
  Top 0.305: CHARGE.C 68.36,4.86 v68.4,4.9
  Top 0.406: IC1.3 53.49,21.49 v53.4,21.4
  Bottom 0.305: v68.4,4.9 68.4,10.3 66.6,12.1 58.8,12.1 56.4,14.5 51.3,14.5 51.3,21.1 51.6,21.4 v53.4,21.4
N$5  (via drill 0.35)
  Top 0.305: v66,20.8 65.4,21.4 64.28,21.4 R3.1
  Top 0.61: IC1.8 R3.1
  Top 0.813: L3.P$2 61.75,29.25 v62.7,28.3
  Bottom 0.813: v66,20.8 66,25 v62.7,28.3
N$6
  Top 0.61: CHARGE.A 68.47,1.81 R1.2 78.38,1.9 79.7,1.9 79.7,5 79.65,5.05 DONE.A
N$7  (via drill 0.35)
  Top 0.305: DONE.C 78.48,7.48 v79.2,8.2
  Top 0.406: IC1.4 53.69,20.49 v53.4,20.2
  Bottom 0.305: v79.2,8.2 72.72,8.2 67.02,13.9 59.1,13.9 56.7,16.3 56.7,17.2 53.7,20.2 v53.4,20.2
N$8
  Top 0.61: R5.2 54.84,19.13 IC1.5
N$9
  Top 0.61: C3.1 54.78,15.74 R5.1
N$10
  Top 0.61: IC1.10 62.63,25.5 Q1.1
N$11
  Top 0.305: U2.9 16.63,26.04 14.97,24.37 14.14,24.37
  Top 1.016: R18.1 14.14,24.37 R17.2
N$12
  Top 0.305: Q1.3 66.24,26.86 62.1,31 62.1,35.8 61.06,36.84 D5.A
N$13
  Top 0.813: D6.C 54.46,36.89 D5.C 54.51,35.05 L3.P$1
N$14
  Top 0.61: R7.2 60.62,18.34 IC1.6
  Top 0.813: R7.2 59.75,17.45 R6.2
N$15
  Top 0.305: Q2.D2_2 72.1,28.32 Q2.D2 Q2.D1 71.8,27.02 Q2.D1_2
N$16
  Top 0.813: 6.63,27.92 5.6,26.89 5.6,18.7 8.33,18.7
  Top 1.016: 6.63,27.92 8.29,27.92 BAT.1 6.6,29.61 6.6,31.9 6.2,32.3 2.4,32.3 S1.4 | 8.33,18.7 BAT2.1
N$17
  Top 0.305: IC2.1 74.1,29.87 74.1,28.3 73.47,27.67 Q2.G1
N$18
  Top 0.305: IC2.3 71.73,32.83 71.7,32.8 71.7,30.1 69.9,30.1 69.3,29.5 69.3,29.13 70.76,27.67 Q2.G2
N$19
  Top 0.61: R9.2 67.84,32.72 C6.1 68.68,31.88 IC2.5
N$20
  Top 0.61: IC2.2 74.63,31.88 R8.2
N$21
  Top 0.254: 91,43.11 94.11,43.11 BOT.2
  Top 0.406: R21.1 91,43.11
N$22
  Top 1.27: PWR.C 65.62,52.67 R14.1
N$24
  Top 1.016: R20.1 3.91,11.4 LBO.A
N$25
  Top 1.016: R20.2 7.79,11.1 10.11,11.1 Q3.C
N$26  (via drill 0.35)
  Top 0.203: v18.8,21.6 19.46,22.27 U2.14
  Top 0.406: v17.4,16.3 R16.2
  Top 0.813: R15.1 17.42,18.38 R16.2
  Bottom 0.406: v17.4,16.3 18.6,16.3 18.6,21.4 v18.8,21.6
N$31
  Top 0.406: R25.2 84.63,16.15 TF1.1 86.05,16.93 R28.1
N$32
  Top 0.305: TF2.1 85.73,23.28 R26.2 86.75,22.6 R29.1
N$33
  Top 0.406: R30.1 86.78,33.06 TL.1 87.23,33.36 R27.2
N$34
  Top 0.406: FAN1.1 93.39,19.64 D8.A 88.76,19.64 87.3,21.1 84.6,21.1 83.53,20.03 TF1.3
N$35
  Top 0.406: FAN2.1 93.64,28.61 D9.A 88.02,29.2 84,29.2 83.53,28.73 TF2.3
N$36
  Top 0.406: TL.3 85.03,36.83 85.5,37.3 92.83,37.3 LED.1
SENSOR
  Route15 0.254: RASP.28 24.74,53.6 19.7,53.6 19.7,49.7
  Route15 0.305: 19.7,49.7 18.2,48.2 10.5,48.2 10.5,44.82 DHT11.2
VBAT  (via drill 0.35)
  Top 0.406: L2.P$1 18.83,27.18 U2.8
  Top 0.61: R3.2 62.73,19.86 62.11,20.49 IC1.7 | C4.1 65.19,18.86 R3.2 | C5.1 63.39,19.06 R3.2
  Top 0.813: v66,29.5 66.2,29.7 R9.1 | v66.6,17.5 66.55,17.45 C4.1 | Q3.E 9.2,14.2 9.9,14.6 11.2,15.4 11.8,15.8 12.6,17.13
  Top 1.016: L2.P$1 17.48,31.74 C9.1 C7.1 15.3,31.56 15.3,34.9 | R18.2 12.6,22.12 12.6,18.4 | 12.6,18.4 12.76,18.24 R19.1 | 12.6,17.13 12.6,18.4 | v16.1,39.5 16.1,35.7
  Top 1.27: S1.1 15.23,34.83 15.3,34.9 16.1,35.7
  Bottom 0.813: v66.6,17.5 67.2,17.5 67.8,18.1 67.8,27.7 v66,29.5 65.7,29.5 63.6,31.6 63.6,41.3
  Bottom 1.016: v16.1,39.5 16.1,40.9 16.5,41.3 63.6,41.3
  pour Top: 11.1,21.9 13.1,21.9 13.1,23.6 11.8,24.9 11.8,30.5 18,30.5 18,27.4 19,27.4 19,35.2 11.1,35.2
  pour Top: 62.7,16.9 65.7,16.9 65.7,19.6 64.8,20.5 61.5,20.5 62.7,19.3
  pour Top: 15.3,18.9 15.9,18.9 15.9,17.6 11.9,17.6 11.9,22 13.1,22 13.1,18.8
VSOL
  Top 0.61: 63.04,22.6 62.93,22.49 IC1.9
  Top 0.813: 63.04,22.6 Q1.2 65.04,22.6 69,22.6 C1.+ 69.42,19.82 69.42,15.78 | R7.1 61.51,13.89 | 61.51,13.89 61.8,13.6 71.12,13.6 D4.C 71.36,15.36 72,16 76.8,16 76.8,4.93 R1.1 | C2.1 58.33,26.37 58.17,26.53 56.36,26.53 56.32,26.5 53.4,26.5 51,24.1 51,13.9 51.3,13.6 61.22,13.6 61.51,13.89
  Top 1.016: D4.C 69.42,15.78
  pour Top: 76.5,8.5 77.7,8.5 77.7,17.2 72.9,17.2 72,18.1 72,23 69,23 69,13.2 72.9,13.2 72.9,15.4 76.5,15.4
  pour Top: 50.7,13 68.4,13 68.4,14.5 51.9,14.5 51.6,14.8 51.6,23.8 53.7,25.9 52.8,26.8 50.1,24.1 50.1,13.6
VSOLAR
  Top 1.27: VIN.2 71.25,9.8 73,9.8 75,11.8 75,13.8 D4.A

### Text on the board
tNames: GND | - | D | + | 5V | + | + | + | + | PCB U 2.0 | + | + | - | 1
bNames: + | + | + | 40